# EAGLE design basic-inline-turbidimeter_main_board_v2.0 (EAGLE 7.7.0)
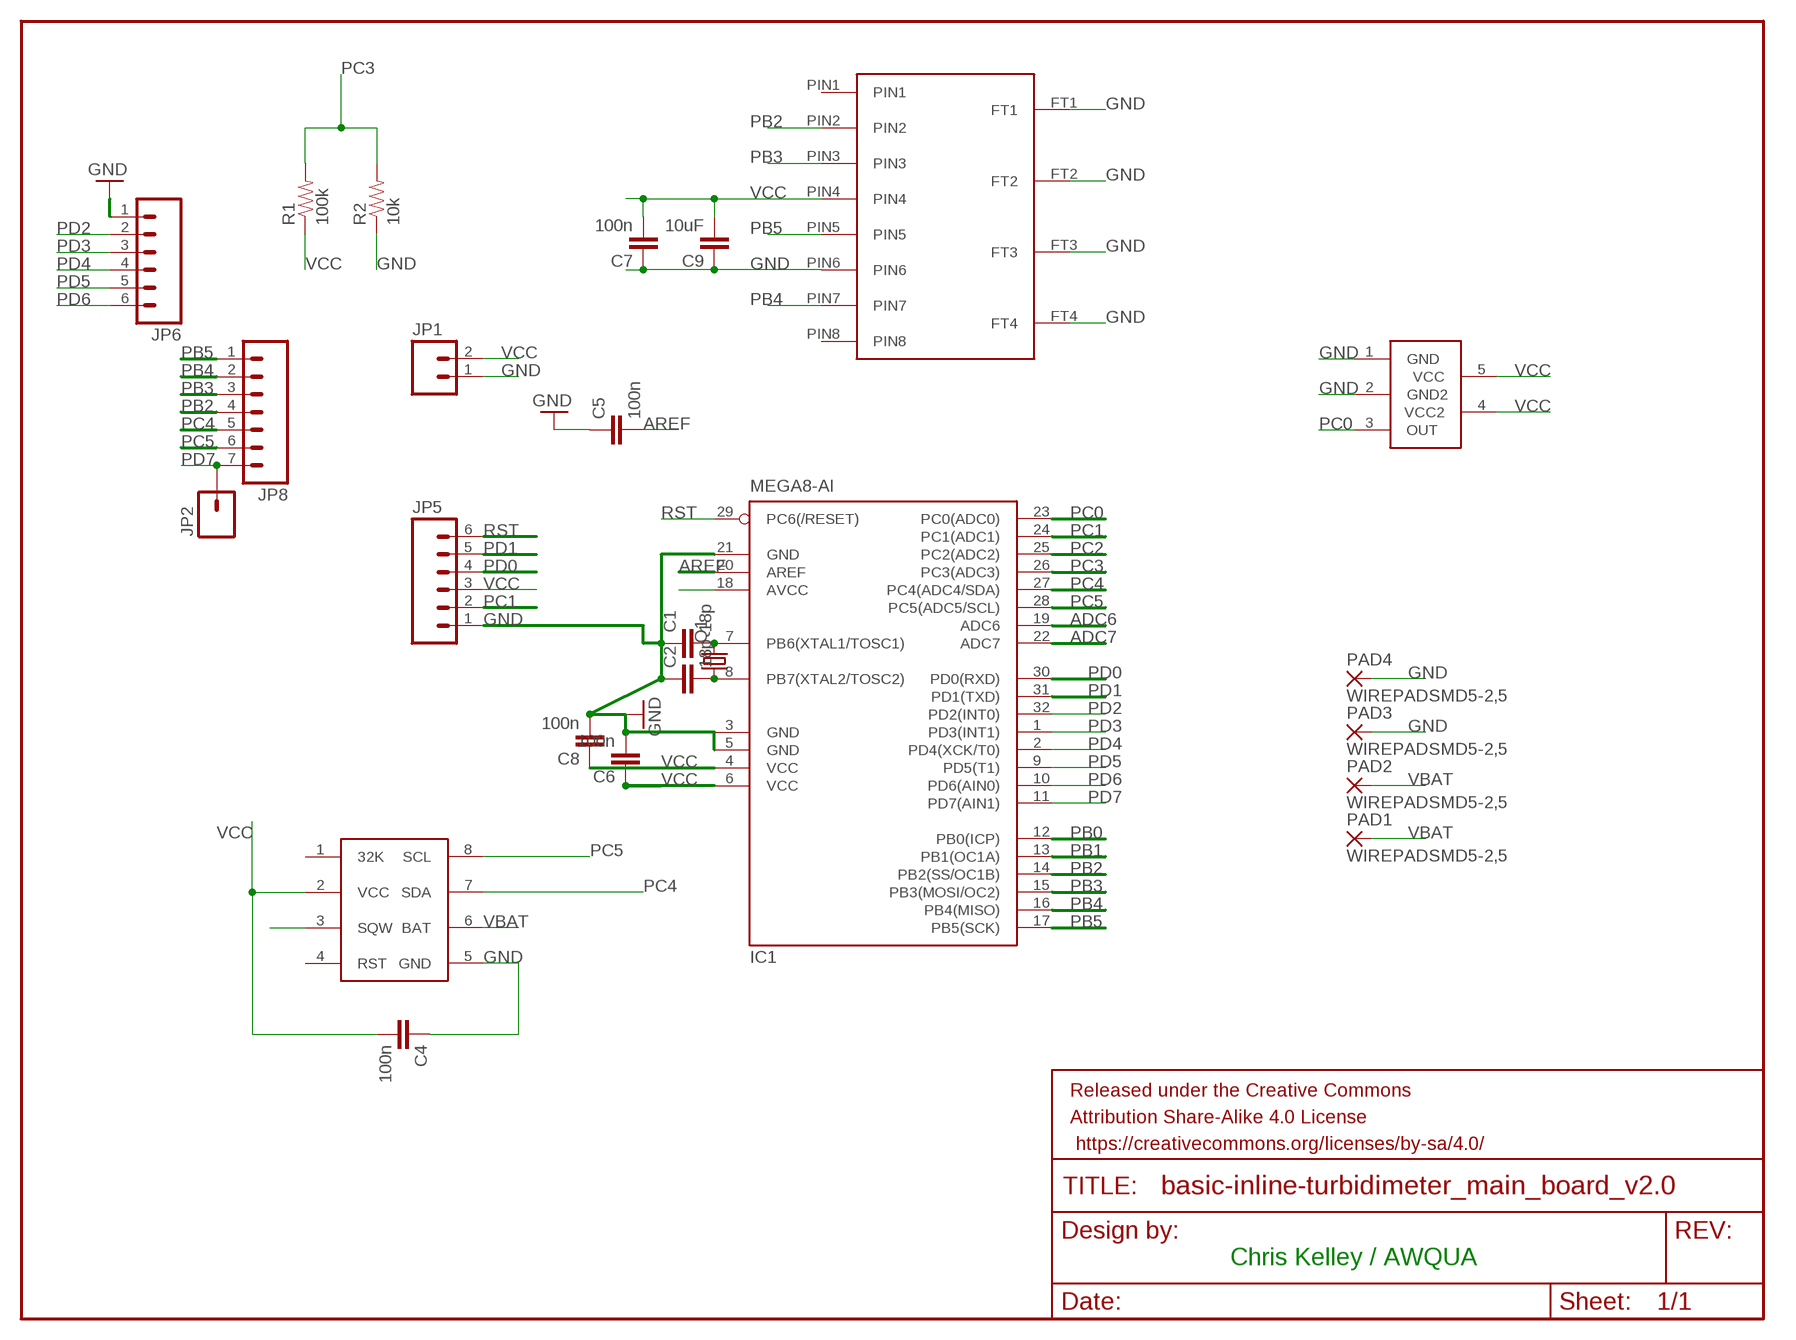
[diagram p0: schematic, sheet 1]

## Parts
*RTC  DS3231M  [DS3231M]
C1  18p  CAP0603-CAP  [0603-CAP]
C2  18p  CAP0603-CAP  [0603-CAP]
C4  100n  CAP0603-CAP  [0603-CAP]
C5  100n  CAP0603-CAP  [0603-CAP]
C6  100n  CAP0603-CAP  [0603-CAP]
C7  100n  CAP0603-CAP  [0603-CAP]
C8  100n  CAP0603-CAP  [0603-CAP]
C9  10uF  CAP0603-CAP  [0603-CAP]
FRAME1  FRAME-LETTER  [CREATIVE_COMMONS]
IC1  MEGA8-AI  [TQFP32-08]
JP1  M02PTH  [1X02]
JP2  M01PTH  [1X01]
JP5  M06SILK_FEMALE_PTH  [1X06]
JP6  M06SILK_FEMALE_PTH  [1X06]
JP8  M07  [1X07]
MICRO-SD  MICROSD-1010030368  [MICROSD-1010030368]
PAD1  WIREPADSMD5-2,5  [5-2,5]
PAD2  WIREPADSMD5-2,5  [5-2,5]
PAD3  WIREPADSMD5-2,5  [5-2,5]
PAD4  WIREPADSMD5-2,5  [5-2,5]
Q1  CRYSTAL5X3  [CRYSTAL-SMD-5X3]
R1  100k  RESISTOR0603  [0603-RES]
R2  10k  RESISTOR0603  [0603-RES]
T1  LMT86  [LMT86]

## Nets
ADC6: IC1.19(ADC6)
ADC7: IC1.22(ADC7)
AREF: C5.2 IC1.20(AREF)
GND: *RTC.5(GND) C1.1 C2.1 C4.1 C5.1 C6.2 C7.1 C8.2 C9.1 IC1.3(GND) IC1.5(GND) IC1.21(GND) JP1.1 JP5.1 JP6.1 MICRO-SD.FT1 MICRO-SD.FT2 MICRO-SD.FT3 MICRO-SD.FT4 MICRO-SD.PIN6 PAD3.1(P) PAD4.1(P) R2.1 T1.1(GND) T1.2(GND2)
N$1: *RTC.3(SQW)
PB0: IC1.12(PB0(ICP))
PB1: IC1.13(PB1(OC1A))
PB2: IC1.14(PB2(SS/OC1B)) JP8.4 MICRO-SD.PIN2
PB3: IC1.15(PB3(MOSI/OC2)) JP8.3 MICRO-SD.PIN3
PB4: IC1.16(PB4(MISO)) JP8.2 MICRO-SD.PIN7
PB5: IC1.17(PB5(SCK)) JP8.1 MICRO-SD.PIN5
PC0: IC1.23(PC0(ADC0)) T1.3(OUT)
PC1: IC1.24(PC1(ADC1)) JP5.2
PC2: IC1.25(PC2(ADC2))
PC3: IC1.26(PC3(ADC3)) R1.2 R2.2
PC4: *RTC.7(SDA) IC1.27(PC4(ADC4/SDA)) JP8.5
PC5: *RTC.8(SCL) IC1.28(PC5(ADC5/SCL)) JP8.6
PD0: IC1.30(PD0(RXD)) JP5.4
PD1: IC1.31(PD1(TXD)) JP5.5
PD2: IC1.32(PD2(INT0)) JP6.2
PD3: IC1.1(PD3(INT1)) JP6.3
PD4: IC1.2(PD4(XCK/T0)) JP6.4
PD5: IC1.9(PD5(T1)) JP6.5
PD6: IC1.10(PD6(AIN0)) JP6.6
PD7: IC1.11(PD7(AIN1)) JP2.1 JP8.7
Q1: C2.2 IC1.8(PB7(XTAL2/TOSC2)) Q1.1
Q2: C1.2 IC1.7(PB6(XTAL1/TOSC1)) Q1.3
RST: IC1.29(PC6(/RESET)) JP5.6
VBAT: *RTC.6(BAT) PAD1.1(P) PAD2.1(P)
VCC: *RTC.2(VCC) C4.2 C6.1 C7.2 C8.1 C9.2 IC1.4(VCC) IC1.6(VCC) IC1.18(AVCC) JP1.2 JP5.3 MICRO-SD.PIN4 R1.1 T1.4(VCC2) T1.5(VCC)
Unconnected: *RTC.1(32K) *RTC.4(RST) MICRO-SD.PIN1 MICRO-SD.PIN8

## Notes on the sheet
- Chris Kelley / AWQUA

## Library data of the parts
*RTC = open_source_turbidimeter:DS3231M
C1 C2 C4-C9 = SparkFun:CAP: Capacitor Standard 0603 ceramic capacitor, and 0.1" leaded capacitor.
FRAME1 = SparkFun-Aesthetics:FRAME-LETTER: Schematic Frame Standard 8.5x11 US Letter frame
IC1 = atmel:MEGA8: MICROCONTROLLER 8 Kbytes FLASH, 1 kbytes SRAM, 512 bytes EEPROM, USART, 6-channel 10 bit ADC, 2-channel 8 bit ADC Pin compatible with Atmega48, ATMega88, ATMega168 Source: avr.lbr; MPN: ATMEGA8-16AU; OC_FARNELL: 9171371; OC_NEWARK: 73M8863
JP1 = SparkFun-Connectors:M02: Standard 2-pin 0.1" header. Use with - straight break away headers ( PRT-00116) - right angle break away headers (PRT-00553) - swiss pins (PRT-00743) - machine pins (PRT-00117) - female headers (PRT-00115) Molex polarized connector foot print use with: PRT-08233 with associated crimp pins and housings. 2.54_SCREWTERM for use with PRT-10571. 3.5mm Screw Terminal footprints for PRT-08084 5mm Screw Terminal footprints for use with PRT-08432
JP2 = SparkFun-Connectors:M01: Header 1 Standard 1-pin 0.1" header. Use with straight break away headers (SKU : PRT-00116), right angle break away headers (PRT-00553), swiss pins (PRT-00743), machine pins (PRT-00117), and female headers (PRT-00115).
JP5 JP6 = SparkFun-Connectors:M06: Header 6 Standard 6-pin 0.1" header. Use with straight break away headers (SKU : PRT-00116), right angle break away headers (PRT-00553), swiss pins (PRT-00743), machine pins (PRT-00117), and female headers (PRT-00115). Molex polarized connector foot print use with SKU : PRT-08094 with associated crimp pins and housings. NOTES ON THE VARIANTS LOCK and LOCK_LONGPADS... This footprint was designed to help hold the alignment of a through-hole component (i.e. 6-pin header) while soldering it into place. You may notice that each hole has been shifted either up or down by 0.005 of an inch from it's more standard position (which is a perfectly straight line). This slight alteration caused the pins (the squares in the middle) to touch the edges of the holes. Because they are alternating, it causes a "brace" to hold the component in place. 0.005 has proven to be the perfect amount of "off-center" position when using our standard breakaway headers. Although looks a little odd when you look at the bare footprint, once you have a header in there, the alteration is very hard to notice. Also,if you push a header all the way into place, it is covered up entirely on the bottom side. This idea of altering the position of holes to aid alignment will be further integrated into the Sparkfun Library for other footprints. It can help hold any component with 3 or more connection pins.; PROD_ID: CONN-08437
JP8 = SparkFun:M07: Header 7 Standard 7-pin 0.1" header. Use with straight break away headers (SKU : PRT-00116), right angle break away headers (PRT-00553), swiss pins (PRT-00743), machine pins (PRT-00117), and female headers (PRT-00115). NOTES ON THE VARIANTS LOCK and LOCK_LONGPADS... This footprint was designed to help hold the alignment of a through-hole component (i.e. 7-pin header) while soldering it into place. You may notice that each hole has been shifted either up or down by 0.005 of an inch from it's more standard position (which is usually a perfectly straight line). This slight alteration caused the pins (the squares in the middle) to touch the edges of the holes. Because they are alternating, it causes a "brace" to hold the header in place. 0.005 has proven to be the perfect amount of "off-center" position when using our standard breakaway headers. Although looks a little odd when you look at the bare footprint, once you have a header in there, the alteration is very hard to notice. Also, if you push a header all the way into place, it is covered up entirely on the bottom side. This idea of altering the position of holes to aid alignment will be further integrated into the Sparkfun Library for other footprints. It can help hold any component with 3 or more connection pins.
MICRO-SD = open_source_turbidimeter:MICROSD-1010030368
PAD1-PAD4 = wirepad:WIREPAD: Wire PAD connect wire on PCB
Q1 = SparkFun:CRYSTAL: Crystals Various standard crystals. Proven footprints. Spark Fun Electronics SKU : COM-00534
R1 R2 = SparkFun-Resistors:RESISTOR: Resistor Basic schematic elements and footprints for 0603, 1206, and PTH resistors.
T1 = open_source_turbidimeter:LMT86

## Board
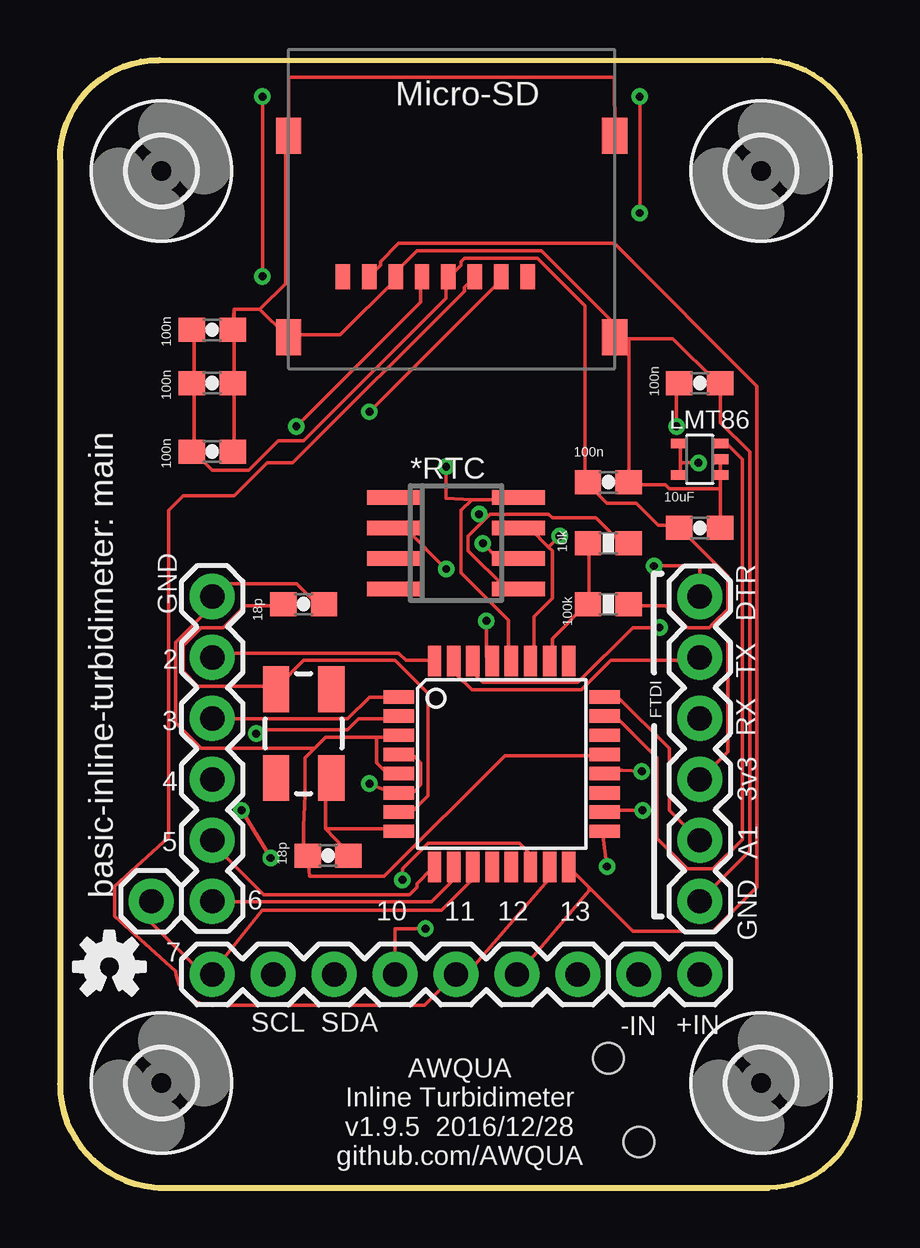
[diagram p1: board, top side]
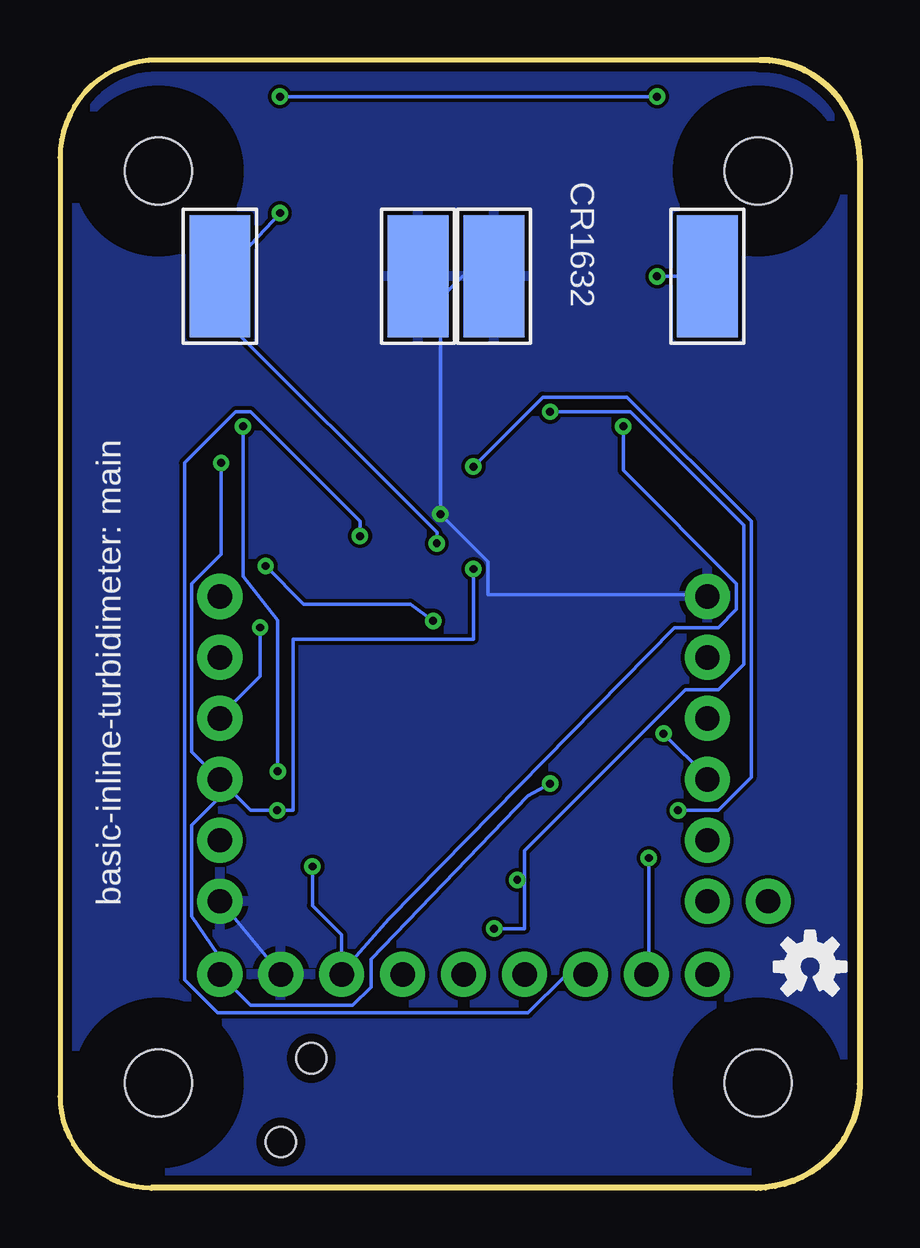
[diagram p2: board, bottom side, seen from below]

Size 33.34 x 46.99 mm. Coordinates in mm from the lower left corner, seen from the top.
Outline: 4.32,0 arc-90 0,4.32 0,42.85 arc-90 4.14,46.99
Outline: 4.13,46.99 29.27,46.99 arc-90 33.34,42.92 33.34,3.81 arc-90 29.53,0 4.13,0
Copper layers (1*16): Top 0.0356mm / dielectric 1.5011mm / Bottom 0.0356mm
Design rules "default *": minimum track width 6mil, minimum drill 13mil, track to track 6mil, track to pad 6mil, pad to pad 6mil, via to via 6mil, smd to smd 6mil, copper to edge 15mil, drill to drill 6mil, minimum pad ring 7mil, minimum via ring 7mil, stop-mask expansion 4mil, vias tented up to drill 15mil, thermal gap 10mil
Holes 1.27 mm at 22.86,5.4 24.13,1.91

### Footprints (pad centres in the part's own frame; a part is rotated, then mirrored left to right if it is on the bottom)
DS3231M = smd 2.2 x 0.6: 1 -2.6,1.905; 2 -2.6,0.635; 3 -2.6,-0.635; 4 -2.6,-1.905; 5 2.6,-1.905; 6 2.6,-0.635; 7 2.6,0.635; 8 2.6,1.905
0603-CAP = smd 1.1 x 1: 1 -0.85,0; 2 0.85,0
TQFP32-08 = smd 1.27 x 0.559: 1 -4.293,2.8; 2 -4.293,2; 3 -4.293,1.2; 4 -4.293,0.4; 5 -4.293,-0.4; 6 -4.293,-1.2; 7 -4.293,-2; 8 -4.293,-2.8; 17 4.293,-2.8; 18 4.293,-2; 19 4.293,-1.2; 20 4.293,-0.4; 21 4.293,0.4; 22 4.293,1.2; 23 4.293,2; 24 4.293,2.8 | smd 0.559 x 1.27: 9 -2.8,-4.293; 10 -2,-4.293; 11 -1.2,-4.293; 12 -0.4,-4.293; 13 0.4,-4.293; 14 1.2,-4.293; 15 2,-4.293; 16 2.8,-4.293; 25 2.8,4.293; 26 2,4.293; 27 1.2,4.293; 28 0.4,4.293; 29 -0.4,4.293; 30 -1.2,4.293; 31 -2,4.293; 32 -2.8,4.293
1X02 = drill 1.016 pad 1.88: 1 0,0; 2 2.54,0
1X01 = drill 1.016 pad 1.88: 1 0,0
1X06 = drill 1.016 pad 1.88: 1 0,0; 2 2.54,0; 3 5.08,0; 4 7.62,0; 5 10.16,0; 6 12.7,0
1X07 = drill 1.016 pad 1.88: 1 0,0; 2 2.54,0; 3 5.08,0; 4 7.62,0; 5 10.16,0; 6 12.7,0; 7 15.24,0
MICROSD-1010030368 = smd 1.05 x 1.5: FT1 0,8.4; FT2 0,0; FT3 13.6,0; FT4 13.6,8.4 | smd 0.6 x 1.05: PIN1 9.97,2.53; PIN2 8.87,2.53; PIN3 7.77,2.53; PIN4 6.67,2.53; PIN5 5.57,2.53; PIN6 4.47,2.53; PIN7 3.37,2.53; PIN8 2.27,2.53
5-2,5 = smd 2.54 x 5.08: 1 0,0
CRYSTAL-SMD-5X3 = smd 1.9 x 1.1: 1 -1.85,-1.15; 2 1.85,-1.15; 3 1.85,1.15; 4 -1.85,1.15
0603-RES = smd 1.1 x 1: 1 -0.85,0; 2 0.85,0
LMT86 = smd 0.4 x 0.7: 1 -0.65,-0.85; 2 0,-0.85; 3 0.65,-0.85; 4 0.65,0.85; 5 -0.65,0.85
2,8 = hole 2.8: 0,0

### Placement (x,y rotation side)
*RTC  16.51,26.86 0 top
C1  10.16,24.32 180 top
C2  11.18,13.84 0 top
C4  6.35,35.75 180 top
C5  26.67,33.53 180 top
C6  6.35,30.67 0 top
C7  22.86,29.4 180 top
C8  6.35,33.53 0 top
C9  26.67,27.5 180 top
FRAME1  15.49,-11.81 0 top  (outside the outline)
IC1  18.41,17.65 0 top
JP1  24.13,8.89 0 top
JP2  3.81,11.94 0 top
JP5  26.67,11.94 90 top
JP6  6.35,24.64 270 top
JP8  21.59,8.89 180 top
MICRO-SD  9.53,35.43 0 top
PAD1  26.67,37.97 0 bottom
PAD2  6.35,37.97 0 bottom
PAD3  18.41,37.97 0 bottom
PAD4  15.24,37.97 0 bottom
Q1  10.16,18.92 90 top
R1  22.86,24.32 180 top
R2  22.86,26.86 180 top
T1  26.67,30.35 90 top
U$1  [2,8]  4.23,42.36 0 top
U$2  [OSHW-LOGO-S]  2.06,9.21 0 top
U$3  [2,8]  29.23,42.36 0 top
U$5  [2,8]  29.23,4.37 0 top
U$6  [2,8]  4.23,4.37 0 top
U$8  [OSHW-LOGO-S]  2.06,9.21 0 bottom

### Tracks (layer width: path | path; a pad name or v marks a point on that pad's centre or on a via)
AREF  (via drill 0.33)
  Top 0.152: v25.7,31.73 25.7,33.4 C5.2 | v24.26,17.35 23.42,17.4 22.81,17.4 IC1.20
  Bottom 0.152: v25.7,31.73 25.7,25.48 24.26,23.65 v24.26,17.35
GND  (via drill 0.33)
  Top 0.152: T1.2 27.53,30.35 27.53,29.74 T1.1 27.53,29.59 27.53,29.13 | 27.53,29.13 27.53,27.61 C9.1 | 27.53,29.13 25.4,29.13 25.25,29.29 23.72,29.29 C7.1 23.72,29.44 23.72,35.38 | 23.72,35.38 23.27,35.38 MICRO-SD.FT3 23.11,35.53 23.11,35.99 20.07,39.04 14.88,39.04 14.12,38.28 14.12,37.97 MICRO-SD.PIN6 13.97,37.82 11.68,35.53 9.55,35.53 MICRO-SD.FT2 9.4,35.53 8.33,36.6 | 23.72,35.38 25.55,35.38 27.38,33.55 C5.1 27.53,33.4 27.53,31.88 28.75,30.66 28.75,14.05 26.77,12.06 JP5.1 | C6.2 7.26,30.81 7.26,33.4 C8.2 7.26,33.55 7.26,36.6 | 8.33,36.6 7.26,36.6 | 8.33,36.6 9.4,37.67 9.4,43.26 MICRO-SD.FT1 9.53,46.27 23.11,46.27 MICRO-SD.FT4 | 7.26,36.6 C4.1 | C1.1 10.92,24.41 10.62,24.41 9.86,25.17 6.81,25.17 6.35,24.71 JP6.1 6.35,24.26 4.83,22.73 4.83,19.38 5.89,18.31 10.62,18.31 | 10.62,18.31 11.07,18.77 13.21,18.77 | 10.62,18.31 10.21,17.91 10.21,16.38 10.16,15.06 10.16,13.89 C2.1 10.41,12.98 13.51,12.98 18.54,18.01 22.66,18.01 IC1.21 | 13.21,18.77 14.12,18.77 IC1.3 | 13.21,18.77 13.21,17.7 13.51,17.4 14.12,17.4 IC1.5 | 17.63,27.76 17.02,27.15 17.02,26.54 18.54,25.02 19,25.02 *RTC.5 | 17.63,27.76 17.93,28.07 20.37,28.07 20.52,27.92 22.35,27.92 23.27,27 23.57,27 R2.1 | 17.63,27.76 17.63,27.92 v17.48,28.07
  Bottom 0.152: JP1.1 24.18,8.97 26.62,11.91 JP5.1 26.62,12.06 | 17.48,37.06 v17.48,28.07 15.49,26.09 15.49,24.71 6.35,24.71 JP6.1 | 17.48,37.06 18.39,37.97 PAD3.1 17.48,37.06 | PAD4.1 16.56,37.97 17.48,37.06
  pour Bottom: -5.4,50.48 39.69,50.48 39.69,-4.13 -5.4,-4.13
PB2  (via drill 0.33)
  Top 0.152: v12.9,32.33 18.39,37.82 MICRO-SD.PIN2 | JP8.4 13.97,10.79 v15.24,10.79 | v14.28,12.83 14.28,13.28 15.34,14.35 19.15,14.35 19.61,13.89 19.61,13.44 IC1.14
  Bottom 0.152: v12.9,32.33 9.55,32.33 4.83,27.61 4.83,21.82 5.89,20.75 7.26,20.75 13.97,14.05 13.97,12.83 | v15.24,10.79 13.97,10.79 13.97,12.83 | 13.97,12.83 v14.28,12.83
PB3
  Top 0.152: MICRO-SD.PIN3 17.17,37.82 16.87,37.52 16.87,37.36 9.7,30.2 8.64,30.2 7.26,28.83 5.13,28.83 4.52,28.22 4.52,14.6 2.29,12.57 2.29,11.3 4.83,9.02 arc90 6.5,7.6 15.19,7.6 16.41,8.81 JP8.3 16.56,8.97 17.02,8.97 20.37,12.83 20.37,13.28 IC1.15
PB4
  Top 0.152: 22.05,12.52 21.29,13.28 IC1.16 | 22.05,12.52 23.88,10.69 27.23,10.69 29.06,12.52 29.06,33.4 23.11,39.34 14.12,39.34 13.36,38.58 13.36,38.43 12.9,37.97 MICRO-SD.PIN7 | 22.05,12.52 22.05,12.37 19.15,8.97 JP8.2
PB5  (via drill 0.33)
  Top 0.152: v9.86,31.73 15.04,36.91 15.04,37.82 MICRO-SD.PIN5 | v22.81,13.39 22.66,14.5 22.66,14.81 IC1.17
  Bottom 0.152: v9.86,31.73 9.86,29.9 5.13,25.17 5.13,24.11 5.89,23.34 7.72,23.34 19.61,11.2 21.59,8.97 JP8.1 21.59,10.54 22.81,11.76 v22.81,13.39
PC0
  Top 0.152: T1.3 27.53,30.96 27.84,30.96 28.45,30.35 28.45,14.5 27.23,13.28 26.16,13.28 24.89,14.55 24.89,17.91 23.27,19.53 22.81,19.53 IC1.23
PC1
  Top 0.152: IC1.24 22.81,20.45 23.27,20.45 25.4,18.31 25.4,15.72 26.62,14.5 JP5.2
PC3
  Top 0.152: R2.2 22.05,26.85 22.05,24.41 R1.2 21.89,24.26 20.52,22.89 20.52,21.97 IC1.26
PC4  (via drill 0.33)
  Top 0.152: 20.37,26.7 19.61,27.46 19.15,27.46 *RTC.7 | 20.37,26.7 20.52,26.54 20.52,24.56 19.76,23.8 19.76,21.97 IC1.27 | 20.37,26.7 v20.83,27.15
  Bottom 0.152: v20.83,27.15 20.83,27.76 25.4,32.33 26.01,32.33 28.14,30.2 28.14,8.66 26.77,7.29 13.82,7.29 12.29,8.81 11.53,8.81 JP8.5
PC5  (via drill 0.33)
  Top 0.152: 17.17,28.68 16.71,28.22 16.71,25.63 18.69,23.65 18.69,21.97 IC1.28 | 17.17,28.68 19,28.68 *RTC.8 | v7.57,15.72 v8.79,13.74 | v16.1,30.05 16.1,28.73 17.17,28.68
  Bottom 0.152: v8.79,13.74 8.79,8.97 JP8.6 | v7.57,15.72 5.89,15.72 4.52,17.09 4.52,27.76 9.7,32.94 13.21,32.94 v16.1,30.05
PD0  (via drill 0.33)
  Top 0.152: v24.99,23.34 23.88,23.34 21.59,21.06 17.63,21.06 17.32,21.36 17.32,21.82 IC1.30
  Bottom 0.152: v24.99,23.34 24.99,21.31 26.62,19.69 JP5.4
PD1
  Top 0.152: IC1.31 16.56,21.82 16.56,21.36 17.17,20.75 21.74,20.75 22.96,21.97 26.62,21.97 JP5.5
PD2
  Top 0.152: IC1.32 15.49,21.97 14.43,21.97 14.12,22.28 6.5,22.28 6.35,22.12 JP6.2
PD3
  Top 0.152: IC1.1 12.9,20.45 11.99,19.53 6.35,19.53 JP6.3
PD4  (via drill 0.33)
  Top 0.152: v8.18,18.92 8.33,19.08 11.99,19.08 12.45,19.53 14.12,19.53 IC1.2
  Bottom 0.152: v8.18,18.92 6.35,17.09 JP6.4
PD5
  Top 0.152: IC1.9 15.49,13.28 14.88,12.67 14.88,12.52 14.58,12.22 8.48,12.22 6.35,14.35 JP6.5
PD6
  Top 0.152: IC1.10 16.41,13.28 16.41,12.83 15.49,11.91 6.35,11.91 JP6.6
PD7
  Top 0.152: IC1.11 17.17,13.28 17.17,12.83 15.9,11.56 8.43,11.56 6.35,8.97 JP8.7 5.97,8.89 3.81,11.05 JP2.1
Q1
  Top 0.152: 11.07,14.96 11.07,16.79 11.23,16.94 Q1.1 | 11.07,14.96 11.84,14.15 C2.2 | 11.07,14.96 14.12,14.96 IC1.8
Q2
  Top 0.152: C1.2 9.25,24.26 7.72,24.26 6.81,23.34 5.89,23.34 5.13,22.58 5.13,21.51 5.74,20.9 8.94,20.9 Q1.3 9.09,20.9 10.16,21.97 13.97,21.97 15.34,20.6 15.34,16.33 14.73,15.72 14.12,15.72 IC1.7
RST  (via drill 0.33)
  Top 0.152: v17.78,23.62 17.78,22.1 IC1.29 | v24.77,25.91 26.67,25.91 JP5.6
  Bottom 0.152: v17.78,23.62 18.73,24.32 23.18,24.32 v24.77,25.91
VBAT  (via drill 0.33)
  Top 0.152: v17.63,26.85 18.24,26.24 19,26.24 *RTC.6 | v8.45,37.97 v8.45,45.47 | v24.17,45.47 v24.17,40.61
  Bottom 0.152: v17.63,26.85 17.63,27.3 26.62,36.3 26.62,37.97 | 26.62,37.97 v24.17,40.61 | 26.62,37.97 PAD1.1 | PAD2.1 v8.45,37.97 | v8.45,45.47 v24.17,45.47
VCC  (via drill 0.33)
  Top 0.152: 27.23,23.5 27.84,24.11 27.84,25.48 25.86,27.46 C9.2 25.7,27.61 24.94,27.61 24.03,28.52 22.81,28.52 22.05,29.29 C7.2 21.89,29.44 21.89,36.75 19.91,38.73 16.87,38.73 16.71,38.58 16.71,38.43 16.26,37.97 MICRO-SD.PIN4 16.1,37.82 16.1,37.06 10.16,31.12 9.09,31.12 7.87,29.9 6.35,29.9 5.59,30.66 C6.1 5.59,30.81 5.59,33.4 C8.1 5.59,33.55 5.59,36.09 C4.2 | 27.23,23.5 27.08,23.34 26.16,23.34 25.25,24.26 23.72,24.26 R1.1 | IC1.4 14.12,18.01 14.73,18.01 15.04,17.7 15.04,16.79 14.73,16.48 14.12,16.48 IC1.6 14.12,16.33 v12.9,16.84 | 25.86,30.2 25.86,30.96 T1.4 | 25.86,30.2 25.86,29.74 T1.5 | v26.62,30.2 25.86,30.2 | v24.28,15.72 22.81,15.72 IC1.18 | v16.1,25.78 14.43,27.46 13.97,27.46 *RTC.2 | 27.23,23.5 27.84,22.89 27.84,18.16 26.77,17.09 JP5.3
  Bottom 0.152: v12.9,16.84 13.82,16.33 20.37,9.52 20.37,8.36 21.13,7.6 25.4,7.6 26.62,8.81 JP1.2 26.77,8.97 26.77,9.73 27.84,11.3 27.84,15.11 26.31,16.64 | v26.62,30.2 26.62,26.39 27.84,25.17 27.84,18.16 26.77,17.09 JP5.3 | 26.31,16.64 26.62,16.94 JP5.3 | 26.31,16.64 25.4,15.72 v24.28,15.72 23.62,15.72 23.62,22.86 16.1,22.86 v16.1,25.78 | 26.31,16.64 JP5.3

### Text on the board
tPlace: DTR | 2 | TX | RX | 3 | FTDI | 3v3 | 4 | 5 | A1 | GND | 6 | 10 | 11 | 12 | 13 | 7 | SCL | SDA | -IN | +IN | AWQUA / Inline Turbidimeter / v1.9.5 2016/12/28 / github.com/AWQUA
tNames: Micro-SD | GND | basic-inline-turbidimeter: main | Chris Kelley / AWQUA
bNames: CR1632 | basic-inline-turbidimeter: main